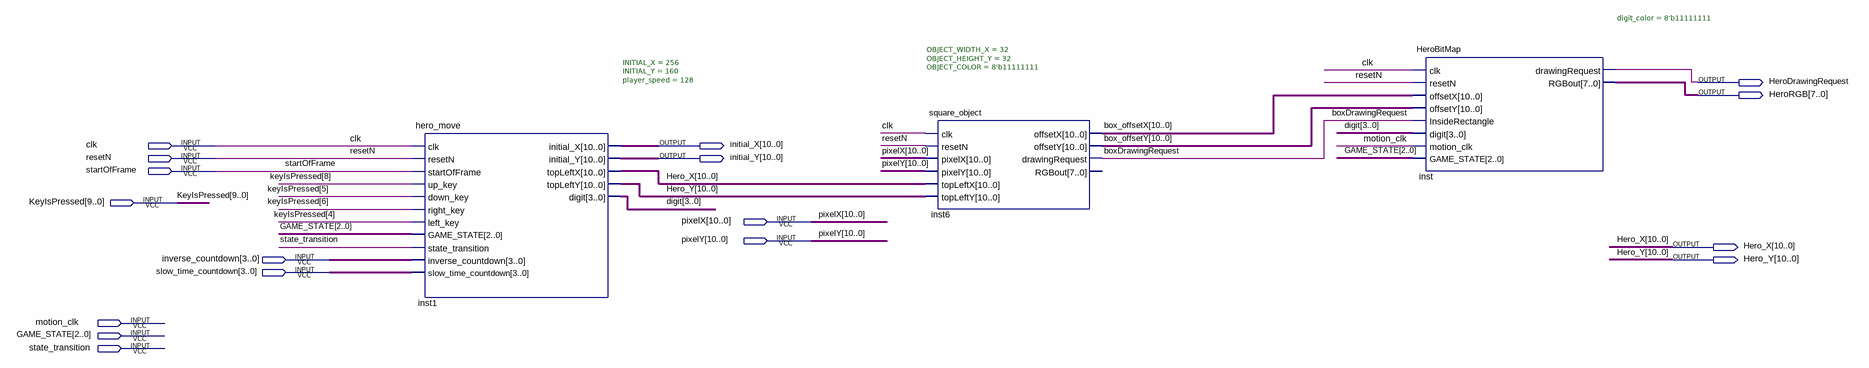
[diagram p0: schematic sheet]
// Quartus schematic HERO.bdf as structural Verilog: 3 symbols, 17 pins
module HERO (
  input  clk,
  input  resetN,
  input  startOfFrame,
  input  [9:0] KeyIsPressed,
  input  [10:0] pixelX,
  input  [10:0] pixelY,
  input  [3:0] inverse_countdown,
  input  [3:0] slow_time_countdown,
  input  motion_clk,
  input  [2:0] GAME_STATE,
  input  state_transition,
  output HeroDrawingRequest,
  output [7:0] HeroRGB,
  output [10:0] initial_X,
  output [10:0] initial_Y,
  output [10:0] Hero_X,
  output [10:0] Hero_Y
);

  wire boxDrawingRequest;
  wire [3:0] digit;
  wire [10:0] box_offsetX, box_offsetY;

  hero_move #(.INITIAL_X(256), .INITIAL_Y(160), .player_speed(128)) inst1 (
    .clk(clk), .resetN(resetN), .startOfFrame(startOfFrame), .up_key(KeyIsPressed[8]),
    .down_key(KeyIsPressed[5]), .right_key(KeyIsPressed[6]), .left_key(KeyIsPressed[4]),
    .GAME_STATE(GAME_STATE), .state_transition(state_transition), .inverse_countdown(inverse_countdown),
    .slow_time_countdown(slow_time_countdown), .initial_X(initial_X), .initial_Y(initial_Y),
    .topLeftX(Hero_X), .topLeftY(Hero_Y), .digit(digit));
  square_object #(.OBJECT_WIDTH_X(32), .OBJECT_HEIGHT_Y(32), .OBJECT_COLOR(8'b11111111)) inst6 (
    .clk(clk), .resetN(resetN), .pixelX(pixelX), .pixelY(pixelY), .topLeftX(Hero_X), .topLeftY(Hero_Y),
    .offsetX(box_offsetX), .offsetY(box_offsetY), .drawingRequest(boxDrawingRequest));  // open: RGBout
  HeroBitMap #(.digit_color(8'b11111111)) inst (
    .clk(clk), .resetN(resetN), .offsetX(box_offsetX), .offsetY(box_offsetY),
    .InsideRectangle(boxDrawingRequest), .digit(digit), .motion_clk(motion_clk), .GAME_STATE(GAME_STATE),
    .drawingRequest(HeroDrawingRequest), .RGBout(HeroRGB));
endmodule
